# Altium schematic sheet clusterwink_rev0.SchDoc: Sunrise Alarm (Clusterwink)
size A4
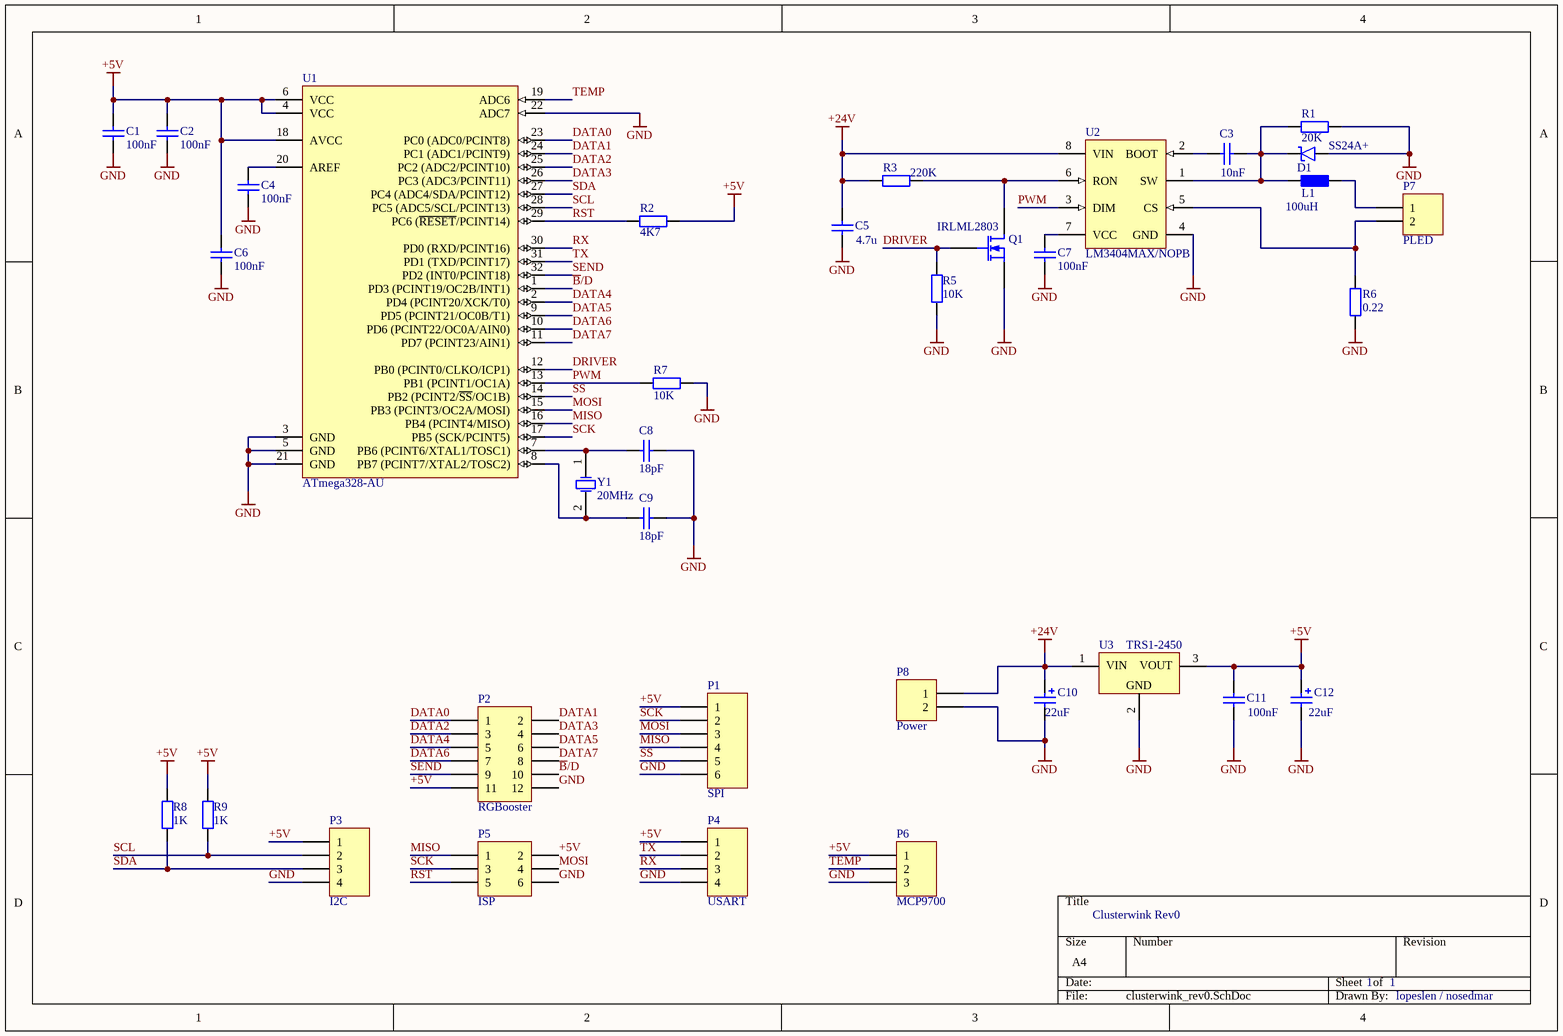
[diagram p0: clusterwink_rev0.SchDoc]

## Parts
C1  value 100nF  [6-0805_M]  (hidden comment: Cap)
C2  value 100nF  [6-0805_M]  (hidden comment: Cap)
C3  value 10nF  [6-0805_M]  (hidden comment: Cap)
C4  value 100nF  [6-0805_M]  (hidden comment: Cap)
C5  value 4.7u  [C1206]  (hidden comment: Cap)
C6  value 100nF  [6-0805_M]  (hidden comment: Cap)
C7  value 100nF  [6-0805_M]  (hidden comment: Cap)
C8  value 18pF  [6-0805_M]  (hidden comment: Cap)
C9  value 18pF  [6-0805_M]  (hidden comment: Cap)
C10  value 22uF  [EEEFK1H220P]  (hidden comment: Cap Pol2)
C11  value 100nF  [6-0805_M]  (hidden comment: Cap)
C12  value 22uF  [EEEFK1H220P]  (hidden comment: Cap Pol2)
D1  SS24A+  [DO-214]
L1  value 100uH  [ELLCTP]  (hidden comment: Ind)
P1  SPI  [HDR1X6]
P2  RGBooster  [Klemme_90deg_inv]
P3  I2C  [HDR1X4]
P4  USART  [HDR1X4]
P5  ISP  [AVR_ISP]
P6  MCP9700  [HDR1X3]
P7  PLED  [HDR1X2]
P8  Power  [HDR1X2]
Q1  IRLML2803  [SOT-23]
R1  value 20K  [6-0805_M]  (hidden comment: Res2)
R2  value 4K7  [6-0805_M]  (hidden comment: Res2)
R3  value 220K  [6-0805_M]  (hidden comment: Res2)
R5  value 10K  [6-0805_M]  (hidden comment: Res2)
R6  value 0.22  [C1206]  (hidden comment: Res2)
R7  value 10K  [6-0805_M]  (hidden comment: Res2)
R8  value 1K  [6-0805_M]  (hidden comment: Res2)
R9  value 1K  [6-0805_M]  (hidden comment: Res2)
U1  ATmega328-AU  [32A_N]
U2  LM3404MAX/NOPB  [M08A_N]
U3  TRS1-2450  [TRS 1-2450]
Y1  20MHz  [CRYSTAL]

## Nets
+5V: C1.2 C2.2 C6.2 C11.2 C12.1 P1.1 P2.11 P3.1 P4.1 P5.2 P6.1 R2.1 R8.1 R9.1 U1.4(VCC) U1.6(VCC) U1.18(AVCC) U3.3(+VOUT)
+24V: C5.2 C10.1 P8.1 R3.1 U2.8(VIN) U3.1(+VIN)
GND: C1.1 C2.1 C4.1 C5.1 C6.1 C7.1 C8.1 C9.1 C10.2 C11.1 C12.2 D1.1(A) P1.6 P2.12 P3.4 P4.4 P5.6 P6.3 P8.2 Q1.3(S) R1.1 R5.1 R6.1 R7.1 U1.3(GND) U1.5(GND) U1.21(GND) U1.22(ADC7) U2.4(GND) U3.2(GND)
~{B}/D: P2.10 U1.1(PD3_(PCINT19/OC2B/INT1))
DATA0: P2.1 U1.23(PC0_(ADC0/PCINT8))
DATA1: P2.2 U1.24(PC1_(ADC1/PCINT9))
DATA2: P2.3 U1.25(PC2_(ADC2/PCINT10))
DATA3: P2.4 U1.26(PC3_(ADC3/PCINT11))
DATA4: P2.5 U1.2(PD4_(PCINT20/XCK/T0))
DATA5: P2.6 U1.9(PD5_(PCINT21/OC0B/T1))
DATA6: P2.7 U1.10(PD6_(PCINT22/OC0A/AIN0))
DATA7: P2.8 U1.11(PD7_(PCINT23/AIN1))
DRIVER: Q1.2(G) R5.2 U1.12(PB0_(PCINT0/CLKO/ICP1))
MISO: P1.4 P5.1 U1.16(PB4_(PCINT4/MISO))
MOSI: P1.3 P5.4 U1.15(PB3_(PCINT3/OC2A/MOSI))
PWM: R7.2 U1.13(PB1_(PCINT1/OC1A)) U2.3(DIM)
RST: P5.5 R2.2 U1.29(PC6_(~{RESET}/PCINT14))
RX: P4.3 U1.30(PD0_(RXD/PCINT16))
~{SS}: P1.5 U1.14(PB2_(PCINT2/~{SS}/OC1B))
SCK: P1.2 P5.3 U1.17(PB5_(SCK/PCINT5))
SCL: P3.2 R9.2 U1.28(PC5_(ADC5/SCL/PCINT13))
SDA: P3.3 R8.2 U1.27(PC4_(ADC4/SDA/PCINT12))
SEND: P2.9 U1.32(PD2_(INT0/PCINT18))
TEMP: P6.2 U1.19(ADC6)
TX: P4.2 U1.31(PD1_(TXD/PCINT17))
NetC3_1: C3.1 U2.2(BOOT)
NetC3_2: C3.2 D1.2(K) L1.1 R1.2 U2.1(SW)
NetC4_2: C4.2 U1.20(AREF)
NetC7_2: C7.2 U2.7(VCC)
NetC8_2: C8.2 U1.7(PB6_(PCINT6/XTAL1/TOSC1)) Y1.1(OSC1)
NetC9_2: C9.2 U1.8(PB7_(PCINT7/XTAL2/TOSC2)) Y1.2(OSC2)
NetL1_2: L1.2 P7.1
NetP7_2: P7.2 R6.2 U2.5(CS)
NetQ1_1: Q1.1(D) R3.2 U2.6(RON)

## Notes on the sheet
- Clusterwink Rev0
- 1
- lopeslen / nosedmar
- (in symbol TSR1-2450) VIN; VOUT

## Library data of the parts
C1-C9 C11 = Cap: Capacitor; Published: 8-Jun-2000; LatestRevisionDate: 17-Jul-2002; LatestRevisionNote: Re-released for DXP Platform.; PackageReference: RAD-0.3; Publisher: Altium Limited; PackageDescription: Radial Cap, Thru-Hole; 2 Leads; 0.3 in Pin Spacing
C10 C12 = Cap Pol2: Polarized Capacitor (Axial); Published: 8-Jun-2000; LatestRevisionDate: 17-Jul-2002; LatestRevisionNote: Re-released for DXP Platform.; PackageReference: POLAR0.8; Publisher: Altium Limited; PackageDescription: Polarized Capacitor; 2 Leads
D1 = Schottky
L1 = Inductor
P1 = Header 6: Header, 6-Pin; LatestRevisionDate: 17-Jul-2002; LatestRevisionNote: Re-released for DXP Platform.; Publisher: Altium Limited
P2 = Header 6X2: Header, 6-Pin, Dual row; LatestRevisionDate: 17-Jul-2002; LatestRevisionNote: Re-released for DXP Platform.; Publisher: Altium Limited
P3 P4 = Header 4: Header, 4-Pin; LatestRevisionDate: 17-Jul-2002; LatestRevisionNote: Re-released for DXP Platform.; Publisher: Altium Limited
P5 = Header 3X2: Header, 3-Pin, Dual row; LatestRevisionDate: 17-Jul-2002; LatestRevisionNote: Re-released for DXP Platform.; Publisher: Altium Limited
P6 = Header 3: Header, 3-Pin; LatestRevisionDate: 17-Jul-2002; LatestRevisionNote: Re-released for DXP Platform.; Publisher: Altium Limited
P7 P8 = Header 2: Header, 2-Pin; LatestRevisionDate: 17-Jul-2002; LatestRevisionNote: Re-released for DXP Platform.; Publisher: Altium Limited
Q1 = MOSFET-N: N-Channel MOSFET; pin to pad: 1>3 2>1 3>2; Published: 8-Jun-2000; LatestRevisionDate: 17-Jul-2002; LatestRevisionNote: Re-released for DXP Platform.; PackageVersion: 1995/1996; PackageReference: E3; Publisher: Altium Limited; PackageDescription: TO, Flat Index; 3 In-Line, Axial Leads; Body Dia. 4.6mm; Lead Dia. 0.5 mm (max)
R1-R3 R5-R9 = Res2: Resistor; Published: 8-Jun-2000; LatestRevisionDate: 17-Jul-2002; LatestRevisionNote: Re-released for DXP Platform.; PackageReference: AXIAL-0.4; Publisher: Altium Limited; PackageDescription: Axial Device, Thru-Hole; 2 Leads; 0.4 in Pin Spacing
U1 = ATmega328-AU: 8-bit AVR Microcontroller, 32KB Flash, 1KB EEPROM, 2KB SRAM, 32-pin TQFP, Industrial Grade (-40°C to 85°C); DatasheetVersion: revD, May-2011; PackageVersion: revC, Oct-2010; PackageReference: 32A; PackageDescription: 32-Lead, 7x7x1.0 mm Body, 0.8mm Lead Pitch, Thin Profile Plastic Quad Flat Package (TQFP); Code_JEDEC: MS-026-ABA; ComponentLink1Description: Manufacturer URL; ComponentLink1URL: http://www.atmel.com/; ComponentLink2Description: ATmega48A/48PA/88A/88PA/168A/168PA/328/328P Datasheet; ComponentLink2URL: http://www.atmel.com/dyn/resources/prod_documents/doc8271.pdf; ComponentLink3Description: ATmega48A/48PA/88A/88PA/168A/168PA/328/328P Summary; ComponentLink3URL: http://www.atmel.com/dyn/resources/prod_documents/8271S.pdf
U2 = LM3404MAX/NOPB: 1.0A Constant Current Buck Regulator for High Power LED Drivers, 8-pin Narrow SOIC, Pb-Free; Manufacturer: National Semiconductor; PackageTopMarking: NSZXTT*L3404*MA; PowerWise: Y; CompType: MiscPower; DatasheetVersion: Jun-2007; PackageVersion: revM, May-2009; PackageReference: M08A; PackageDescription: SOIC Narrow, 4.9 x 3.9 x 1.45mm, 8 Lead, 1.27mm Pitch; PartNumber: LM3404MAX/NOPB; RoHS: Y; PinCount: 8; High-Reliability: Y; Code_JEDEC: MS-012-AA; Code_IPC: SOIC127P600-8; ComponentLink1Description: Manufacturer URL; ComponentLink1URL: http://www.national.com/; ComponentLink2Description: LM3404 Datasheet; ComponentLink2URL: http://www.national.com/ds/LM/LM3404.pdf; ComponentLink3Description: LM3404 Web Page; ComponentLink3URL: http://www.national.com/pf/LM/LM3404.html; ComponentLink4Description: M08A Package Page; ComponentLink4URL: http://www.national.com/packaging/folders/m08a.html
U3 = TSR1-2450
Y1 = XTAL: Crystal Oscillator; Published: 8-Jun-2000; LatestRevisionDate: 17-Jul-2002; LatestRevisionNote: Re-released for DXP Platform.; PackageReference: R38; Publisher: Altium Limited; PackageDescription: Crystal, Thru-Hole; 2 Leads; Body 3.1 x 8.2 mm (Dia.xH)